# Altium schematic sheet MCU.SchDoc
size A3; SheetNumber: 2; SheetTotal: 5
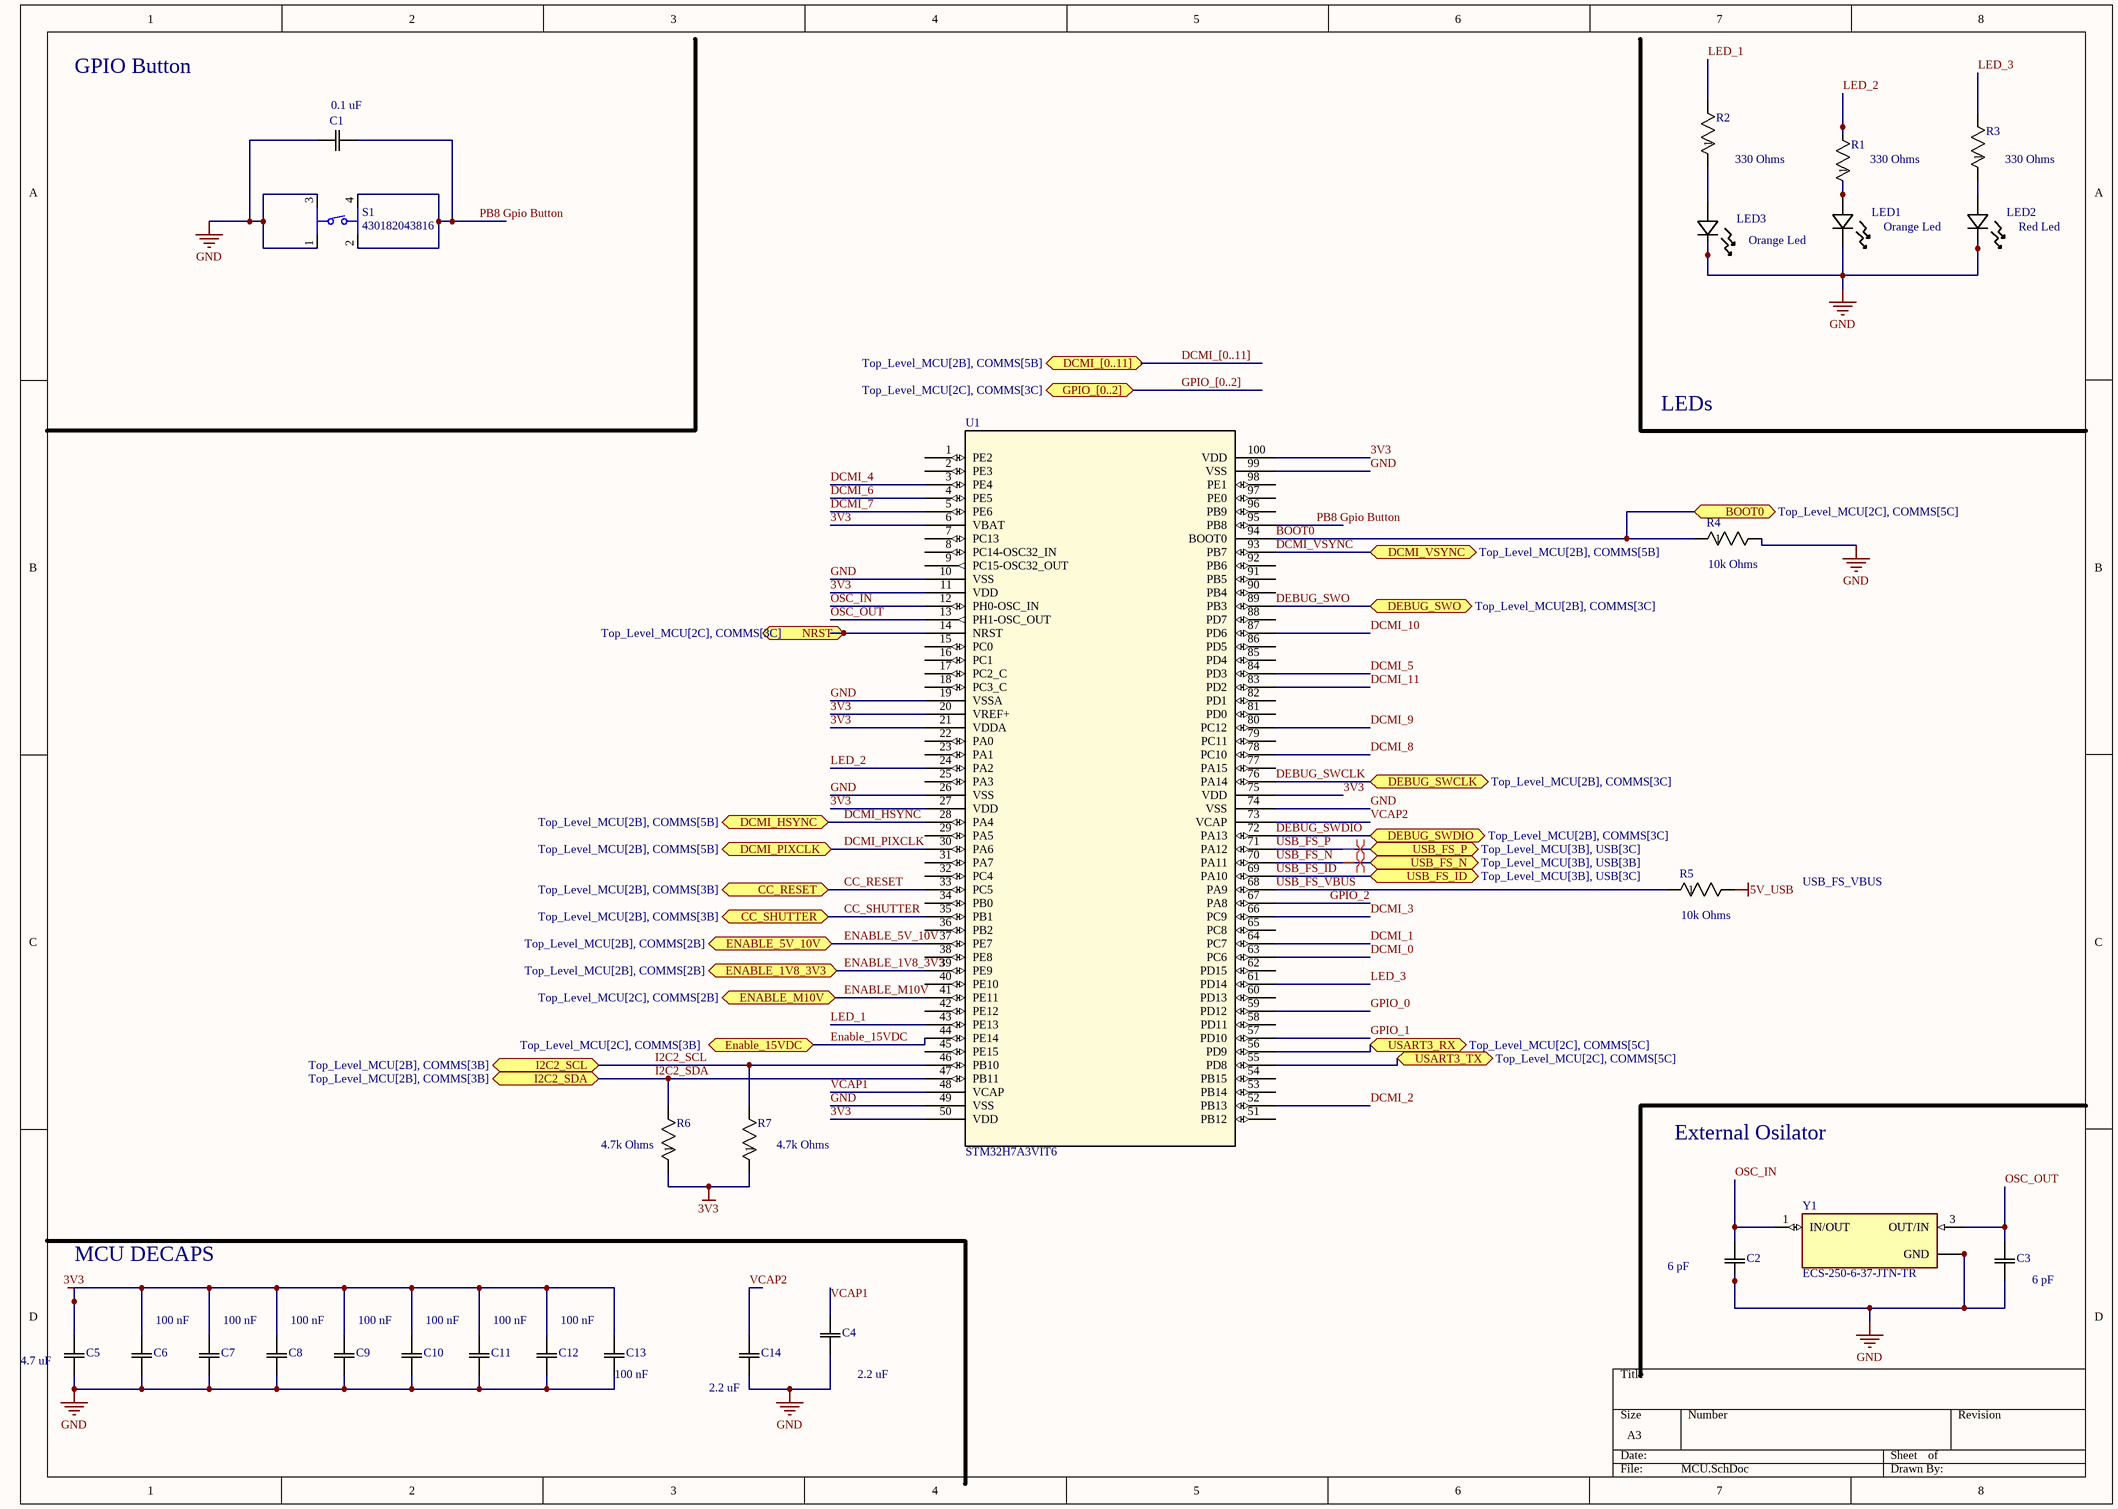
[diagram p0: MCU.SchDoc]

## Parts
C1  CC0805KRX7R7BB104  [CC0805N_YAG]  (value not drawn)
C2  CC0805KRX7R7BB104  [CC0805N_YAG]  (value not drawn)
C3  CC0805KRX7R7BB104  [CC0805N_YAG]  (value not drawn)
C4  CC0805KRX7R7BB104  [CC0805N_YAG]  (value not drawn)
C5  CC0805KRX7R7BB104  [CC0805N_YAG]  (value not drawn)
C6  CC0805KRX7R7BB104  [CC0805N_YAG]  (value not drawn)
C7  CC0805KRX7R7BB104  [CC0805N_YAG]  (value not drawn)
C8  CC0805KRX7R7BB104  [CC0805N_YAG]  (value not drawn)
C9  CC0805KRX7R7BB104  [CC0805N_YAG]  (value not drawn)
C10  CC0805KRX7R7BB104  [CC0805N_YAG]  (value not drawn)
C11  CC0805KRX7R7BB104  [CC0805N_YAG]  (value not drawn)
C12  CC0805KRX7R7BB104  [CC0805N_YAG]  (value not drawn)
C13  CC0805KRX7R7BB104  [CC0805N_YAG]  (value not drawn)
C14  CC0805KRX7R7BB104  [CC0805N_YAG]  (value not drawn)
LED1  LTST-C170KFKT  [LED_LTST-C170KFKT_LTO]  (value not drawn)
LED2  LTST-C171KRKT  [LED_LTST-C171_LTO]  (value not drawn)
LED3  LTST-C170KFKT  [LED_LTST-C170KFKT_LTO]  (value not drawn)
R1  RC0805FR-074K7L  [RES_RC0805_YAG]  (value not drawn)
R2  RC0805FR-074K7L  [RES_RC0805_YAG]  (value not drawn)
R3  RC0805FR-074K7L  [RES_RC0805_YAG]  (value not drawn)
R4  RC0805FR-074K7L  [RES_RC0805_YAG]  (value not drawn)
R5  RC0805FR-074K7L  [RES_RC0805_YAG]  (value not drawn)
R6  RC0805FR-074K7L  [RES_RC0805_YAG]  (value not drawn)
R7  RC0805FR-074K7L  [RES_RC0805_YAG]  (value not drawn)
S1  430182043816  [430182043816]
U1  STM32H7A3VIT6  [LQFP100]
Y1  ECS-250-6-37-JTN-TR  [XTAL_ECS-250-6-37-JTN-TR]

## Ports
BOOT0 (bidir, see Top_Level_MCU[2C], COMMS[5C]), CC_RESET (bidir, see Top_Level_MCU[2B], COMMS[3B]), CC_SHUTTER (bidir, see Top_Level_MCU[2B], COMMS[3B]), DCMI_[0..11] (bidir, see Top_Level_MCU[2B], COMMS[5B]), DCMI_HSYNC (bidir, see Top_Level_MCU[2B], COMMS[5B]), DCMI_PIXCLK (bidir, see Top_Level_MCU[2B], COMMS[5B]), DCMI_VSYNC (bidir, see Top_Level_MCU[2B], COMMS[5B]), DEBUG_SWCLK (bidir, see Top_Level_MCU[2B], COMMS[3C]), DEBUG_SWDIO (bidir, see Top_Level_MCU[2B], COMMS[3C]), DEBUG_SWO (bidir, see Top_Level_MCU[2B], COMMS[3C]), ENABLE_1V8_3V3 (bidir, see Top_Level_MCU[2B], COMMS[2B]), ENABLE_5V_10V (bidir, see Top_Level_MCU[2B], COMMS[2B]), Enable_15VDC (bidir, see Top_Level_MCU[2C], COMMS[3B]), ENABLE_M10V (bidir, see Top_Level_MCU[2C], COMMS[2B]), GPIO_[0..2] (bidir, see Top_Level_MCU[2C], COMMS[3C]), I2C2_SCL (bidir, see Top_Level_MCU[2B], COMMS[3B]), I2C2_SDA (bidir, see Top_Level_MCU[2B], COMMS[3B]), NRST (bidir, see Top_Level_MCU[2C], COMMS[3C]), USART3_RX (bidir, see Top_Level_MCU[2C], COMMS[5C]), USART3_TX (bidir, see Top_Level_MCU[2C], COMMS[5C]), USB_FS_ID (bidir, see Top_Level_MCU[3B], USB[3C]), USB_FS_N (bidir, see Top_Level_MCU[3B], USB[3B]), USB_FS_P (bidir, see Top_Level_MCU[3B], USB[3C])

## Nets
3V3: C5.2 C6.2 C7.2 C8.2 C9.2 C10.2 C11.2 C12.2 C13.2 R6.1 R7.1 U1.6(VBAT) U1.11(VDD) U1.20(VREF+) U1.21(VDDA) U1.27(VDD) U1.50(VDD) U1.75(VDD) U1.100(VDD)
5V_USB: R5.2
GND: C1.1 C2.1 C3.1 C4.1 C5.1 C6.1 C7.1 C8.1 C9.1 C10.1 C11.1 C12.1 C13.1 C14.1 LED1.1 LED2.1(CATHODE) LED3.1 R4.2 S1.1 S1.3 U1.10(VSS) U1.19(VSSA) U1.26(VSS) U1.49(VSS) U1.74(VSS) U1.99(VSS) Y1.2(GND) Y1.4(GND)
BOOT0: R4.1 U1.94(BOOT0) ; port BOOT0
CC_RESET: U1.33(PC5) ; port CC_RESET
CC_SHUTTER: U1.35(PB1) ; port CC_SHUTTER
DCMI_0: U1.63(PC6)
DCMI_1: U1.64(PC7)
DCMI_2: U1.52(PB13)
DCMI_3: U1.66(PC9)
DCMI_4: U1.3(PE4)
DCMI_5: U1.84(PD3)
DCMI_6: U1.4(PE5)
DCMI_7: U1.5(PE6)
DCMI_8: U1.78(PC10)
DCMI_9: U1.80(PC12)
DCMI_10: U1.87(PD6)
DCMI_11: U1.83(PD2)
DCMI_HSYNC: U1.28(PA4) ; port DCMI_HSYNC
DCMI_PIXCLK: U1.30(PA6) ; port DCMI_PIXCLK
DCMI_VSYNC: U1.93(PB7) ; port DCMI_VSYNC
DEBUG_SWCLK: U1.76(PA14) ; port DEBUG_SWCLK
DEBUG_SWDIO: U1.72(PA13) ; port DEBUG_SWDIO
DEBUG_SWO: U1.89(PB3) ; port DEBUG_SWO
ENABLE_1V8_3V3: U1.39(PE9) ; port ENABLE_1V8_3V3
ENABLE_5V_10V: U1.37(PE7) ; port ENABLE_5V_10V
Enable_15VDC: U1.44(PE14) ; port Enable_15VDC
ENABLE_M10V: U1.41(PE11) ; port ENABLE_M10V
GPIO_0: U1.59(PD12)
GPIO_1: U1.57(PD10)
GPIO_2: U1.67(PA8)
I2C2_SCL: R7.2 U1.46(PB10) ; port I2C2_SCL
I2C2_SDA: R6.2 U1.47(PB11) ; port I2C2_SDA
LED_1: R2.2 U1.43(PE13)
LED_2: R1.2 U1.24(PA2)
LED_3: R3.2 U1.61(PD14)
NRST: U1.14(NRST) ; port NRST
OSC_IN: C2.2 U1.12(PH0-OSC_IN) Y1.1(IN/OUT)
OSC_OUT: C3.2 U1.13(PH1-OSC_OUT) Y1.3(OUT/IN)
PB8 Gpio Button: C1.2 S1.2 S1.4 U1.95(PB8)
USART3_RX: U1.56(PD9) ; port USART3_RX
USART3_TX: U1.55(PD8) ; port USART3_TX
USB_FS_ID: U1.69(PA10) ; port USB_FS_ID
USB_FS_N: U1.70(PA11) ; port USB_FS_N
USB_FS_P: U1.71(PA12) ; port USB_FS_P
USB_FS_VBUS: R5.1 U1.68(PA9)
VCAP1: C4.2 U1.48(VCAP)
VCAP2: C14.2 U1.73(VCAP)
NetLED1_2: LED1.2 R1.1
NetLED2_2: LED2.2(ANODE) R3.1
NetLED3_2: LED3.2 R2.1

Not connected (* = marked no-connect by the designer): U1 1(PE2) 2(PE3) 7(PC13) 8(PC14-OSC32_IN) 9(PC15-OSC32_OUT) 15(PC0) 16(PC1) 17(PC2_C) 18(PC3_C) 22(PA0) 23(PA1) 25(PA3) 29(PA5) 31(PA7) 32(PC4) 34(PB0) 36(PB2) 38(PE8) 40(PE10) 42(PE12) 45(PE15) 51(PB12) 53(PB14) 54(PB15) 58(PD11) 60(PD13) 62(PD15) 65(PC8) 77(PA15) 79(PC11) 81(PD0) 82(PD1) 85(PD4) 86(PD5) 88(PD7) 90(PB4) 91(PB5) 92(PB6) 96(PB9) 97(PE0) 98(PE1)

## Buses and harness runs
bus DCMI_[0..11] = port DCMI_[0..11]
bus GPIO_[0..2] = port GPIO_[0..2]

## Layout directives
differential pair: USB_FS_N, USB_FS_P

## Notes on the sheet
- GPIO Button
- (near C1) 0.1 uF
- (near R2) 330 Ohms
- (near R1) 330 Ohms
- (near R3) 330 Ohms
- Orange Led
- (near LED2) Red Led
- LEDs
- (near R4) 10k Ohms
- (near R5) 10k Ohms
- USB_FS_VBUS
- (near R6) 4.7k Ohms
- (near R7) 4.7k Ohms
- External Osilator
- MCU DECAPS
- 100 nF
- (near C2) 6 pF
- (near C3) 6 pF
- (near C5) 4.7 uF
- (near C13) 100 nF
- (near C14) 2.2 uF
- (near C4) 2.2 uF

## Library data of the parts
C1-C14 = CC0805KRX7R7BB104: Description; Manufacturer_Name: Yageo; Copyright: Copyright (C) 2025 Ultra Librarian. All rights reserved.; Manufacturer_Part_Number: CC0805KRX7R7BB104
LED1 LED3 = LTST-C170KFKT: Description; Manufacturer_Name: LITE-ON; Copyright: Copyright (C) 2025 Ultra Librarian. All rights reserved.; Manufacturer_Part_Number: LTST-C170KFKT
LED2 = LTST-C171KRKT: Description; Manufacturer_Name: LITE-ON; Type: LED Indication; Copyright: Copyright (C) 2025 Ultra Librarian. All rights reserved.; Manufacturer_Part_Number: LTST-C171KRKT
R1-R7 = RC0805FR-074K7L: RES SMD 4.7 k? 1% 1/8W 0805; Manufacturer_Name: Yageo; Copyright: Copyright (C) 2025 Ultra Librarian. All rights reserved.; Manufacturer_Part_Number: RC0805FR-074K7L
S1 = 430182043816: 6*6mm vertical type, SMT, height 4.3mm, black actuator, 160gf, T&R; MF: Wurth Electronics; SnapEDA_Link: https://www.snapeda.com/parts/430182043816/Wurth+Electronics/view-part/?ref=snap; Package: None; Value: *; MP: 430182043816; Check_prices: https://www.snapeda.com/parts/430182043816/Wurth+Electronics/view-part/?ref=eda
U1 = STM32H7A3VIT6: High-performance and DSP with DP-FPU, Arm Cortex-M7  MCU with 2MBytes of Flash memory, 1376 KB SRAM, 280 MHz CPU, L1 cache, graphic accelerations, external memory interfaces, SMPS and large set of peripherals; Manufacturer_Name: STMicroelectronics; Copyright: Copyright (C) 2025 Ultra Librarian. All rights reserved.; Manufacturer_Part_Number: STM32H7A3VIT6; RefDes: RefDes; Type: Type
Y1 = ECS-250-6-37-JTN-TR: SMD Crystal 2.0 x 1.6 x 0.45 mm ceramic package; Package: None; Price: None; Value: *; MP: ECS-250-6-37-JTN-TR; Availability: Unavailable; ComponentLink1Description: New link; ComponentLink1URL: *